# Altium schematic sheet 07_E_ink_display_Button_control.SchDoc
size A3; SheetNumber: 7; SheetTotal: 7
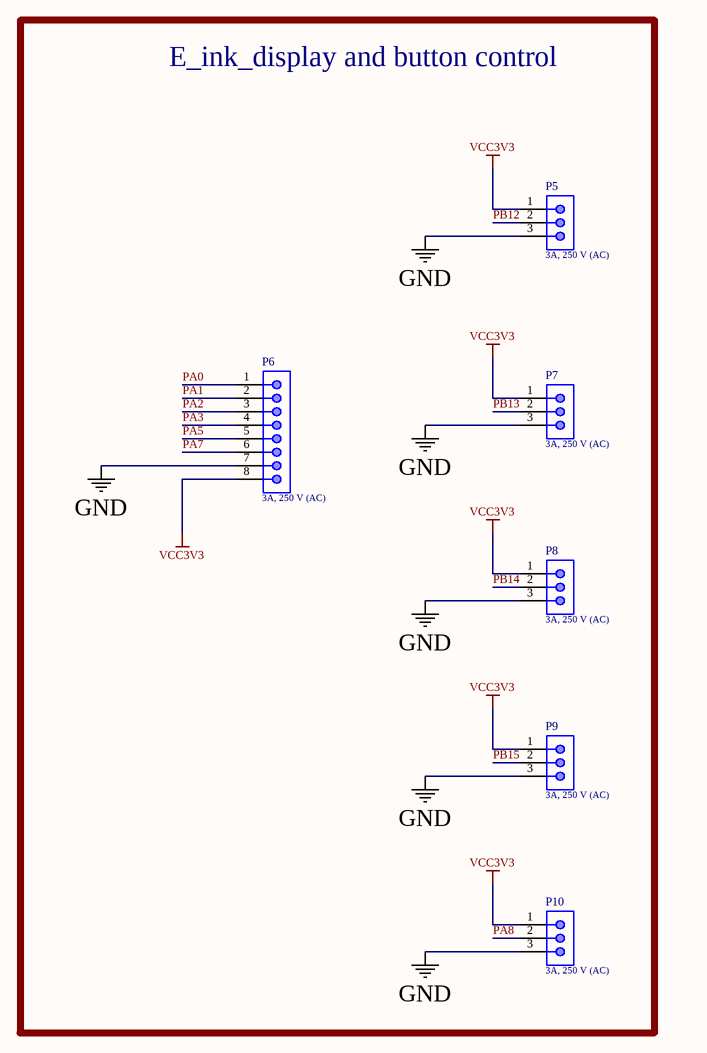
[diagram p0: 07_E_ink_display_Button_control.SchDoc]

## Parts
P5  3A, 250 V (AC)  [61300311121]
P6  3A, 250 V (AC)  [61300811121]
P7  3A, 250 V (AC)  [61300311121]
P8  3A, 250 V (AC)  [61300311121]
P9  3A, 250 V (AC)  [61300311121]
P10  3A, 250 V (AC)  [61300311121]

## Blocks framed on the sheet
E_ink_display and button control: P5-P10

## Nets
GND: P5.3 P6.7 P7.3 P8.3 P9.3 P10.3
VCC3V3: P5.1 P6.8 P7.1 P8.1 P9.1 P10.1
PA0: P6.1
PA1: P6.2
PA2: P6.3
PA3: P6.4
PA5: P6.5
PA7: P6.6
PA8: P10.2
PB12: P5.2
PB13: P7.2
PB14: P8.2
PB15: P9.2

## Library data of the parts
P5 P7-P10 = 61300311121: WR-PHD Pin Header, THT, pitch 2.54mm, Single Row, Vertical, 3p; Manufacturer: Wurth Elektronik; Pin Number: 3; Working Voltage: 250VAC; Withstanding Voltage: 500VAC; Contact Resistance: 20mOhm; ComponentLink1Description: Datasheet; ComponentLink1URL: https://www.we-online.com/catalog/datasheet/61300311121.pdf; Manufacturer Part Number: 61300311121; Published Date: May 2020; Pitch: 2.54mm; Packaging: Bag; Gender: Pin Header; Rated Current: 3A; Row Number: Single; Orientation: Vertical; Supplier 1 URL: https://www.mouser.vn/ProductDetail/Wurth-Elektronik/61300311121?qs=PhR8RmCirEYxRWFJzNKsUw%3D%3D; Supplier 2 URL: N/A; Supplier 3 URL: N/A; LCSC Part #: C2937625; Mount: THT; Operating Temperature Max: + 85 C; Operating Temperature Min: - 25 C; Supplier 1: Mouser; Supplier 1 Part Number: 710-61300311121; Supplier 2: Digi-Key; Supplier 2 Part Number: N/A; Supplier 3: thegioiic; Supplier 3 Part Number: N/A; Value: 3A, 250 V (AC)
P6 = 61300811121: WR-PHD Pin Header, THT, pitch 2.54mm, Single Row, Vertical, 8p; Manufacturer: Wurth Elektronik; Pin Number: 8; Working Voltage: 250VAC; Withstanding Voltage: 500VAC; Contact Resistance: 20mOhm; ComponentLink1Description: Datasheet; ComponentLink1URL: https://www.we-online.com/catalog/datasheet/61300811121.pdf; Manufacturer Part Number: 61300811121; Published Date: May 2020; Pitch: 2.54mm; Packaging: Bag; Gender: Pin Header; Rated Current: 3A; Row Number: Single; Orientation: Vertical; Supplier 1 URL: https://www.mouser.vn/ProductDetail/Wurth-Elektronik/61300811121?qs=PhR8RmCirEZRdx%252BVlEmRRA%3D%3D; Supplier 2 URL: N/A; Supplier 3 URL: N/A; LCSC Part #: N/A; Mount: THT; Operating Temperature Max: + 85 C; Operating Temperature Min: - 25 C; Supplier 1: Mouser; Supplier 1 Part Number: 710-61300811121; Supplier 2: Digi-Key; Supplier 2 Part Number: N/A; Supplier 3: thegioiic; Supplier 3 Part Number: N/A; Value: 3A, 250 V (AC)